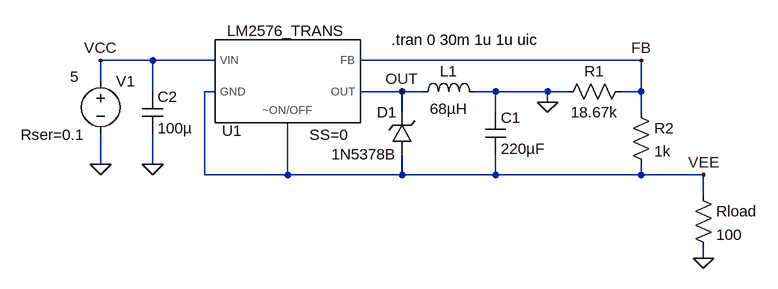
[diagram p0: schematic lm2576-negative.asc]
lm2576-negative.asc, the LTspice schematic file:
Version 4
SHEET 1 984 680
WIRE 0 128 -80 128
WIRE 96 128 0 128
WIRE 752 128 320 128
WIRE -80 160 -80 128
WIRE 0 176 0 128
WIRE 96 176 80 176
WIRE 384 176 320 176
WIRE 416 176 384 176
WIRE 528 176 496 176
WIRE 608 176 528 176
WIRE 640 176 608 176
WIRE 752 176 752 128
WIRE 752 176 720 176
WIRE 608 192 608 176
WIRE 384 208 384 176
WIRE 528 208 528 176
WIRE 752 208 752 176
WIRE -80 288 -80 240
WIRE 0 288 0 240
WIRE 80 304 80 176
WIRE 208 304 208 224
WIRE 208 304 80 304
WIRE 384 304 384 272
WIRE 384 304 208 304
WIRE 528 304 528 272
WIRE 528 304 384 304
WIRE 752 304 752 288
WIRE 752 304 528 304
WIRE 848 304 752 304
WIRE 848 336 848 304
WIRE 848 432 848 416
FLAG -80 288 0
FLAG 0 288 0
FLAG 608 192 0
FLAG 848 304 VEE
FLAG -80 128 VCC
FLAG 752 128 FB
FLAG 384 176 OUT
FLAG 848 432 0
SYMBOL LM2576_TRANS 208 160 R0
WINDOW 0 -86 92 Bottom 2
WINDOW 3 -2 -93 Top 2
WINDOW 39 63 67 Top 2
SYMATTR InstName U1
SYMBOL voltage -80 144 R0
WINDOW 123 0 0 Left 0
WINDOW 39 -123 98 Left 2
WINDOW 3 -47 9 Left 2
SYMATTR SpiceLine Rser=0.1
SYMATTR InstName V1
SYMATTR Value 5
SYMBOL zener 400 272 R180
WINDOW 0 24 64 Left 2
WINDOW 3 24 0 Left 2
SYMATTR InstName D1
SYMATTR Value 1N5378B
SYMBOL ind 400 192 R270
WINDOW 0 32 56 VTop 2
WINDOW 3 5 56 VBottom 2
SYMATTR InstName L1
SYMATTR Value 68µH
SYMBOL cap 512 208 R0
SYMATTR InstName C1
SYMATTR Value 220µF
SYMBOL cap -16 176 R0
SYMATTR InstName C2
SYMATTR Value 100µ
SYMBOL res 624 192 R270
WINDOW 0 32 56 VTop 2
WINDOW 3 0 56 VBottom 2
SYMATTR InstName R1
SYMATTR Value 18.67k
SYMBOL res 736 192 R0
SYMATTR InstName R2
SYMATTR Value 1k
SYMBOL res 832 320 R0
SYMATTR InstName Rload
SYMATTR Value 100
TEXT 368 96 Left 2 !.tran 0 30m 1u 1u uic

The netlist it stands for:
* lm2576-negative.asc
XU1 VCC OUT VEE FB VEE LM2576_TRANS SS=0  ; pins VIN OUT GND FB ~ON/OFF
V1 VCC 0 5 Rser=0.1
D1 VEE OUT 1N5378B
L1 OUT 0 68µH
C1 0 VEE 220µF
C2 VCC 0 100µ
R1 0 FB 18.67k
R2 FB VEE 1k
Rload VEE 0 100
.model D D
.lib standard.dio
.tran 0 30m 1u 1u uic
.lib LM2576_TRANS.LIB
.backanno
.end